# EAGLE design attiniest85-batty-shield-mk-1.0 (EAGLE 6.5.0)
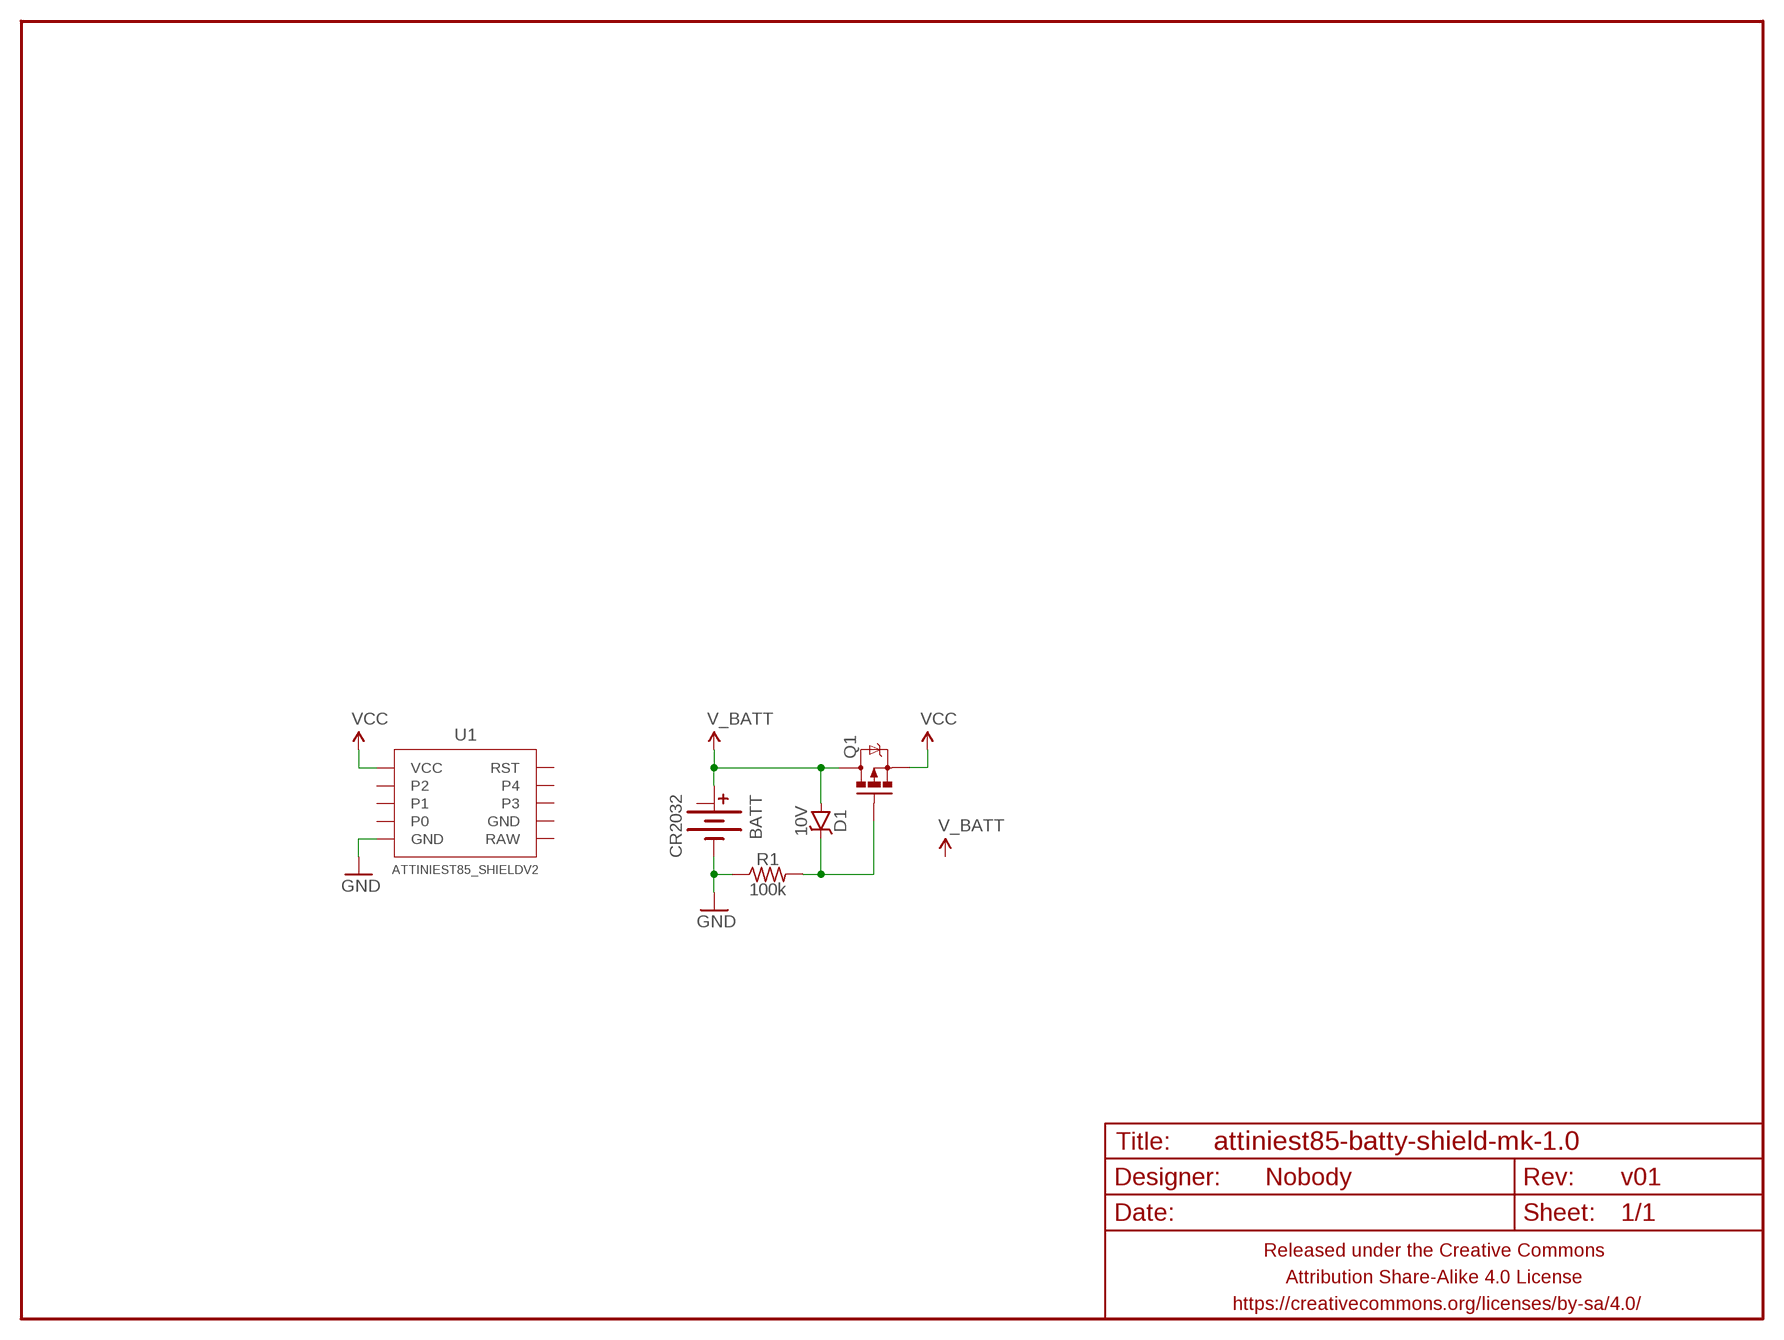
[diagram p0: schematic, sheet 1]

## Parts
BATT  CR2032  BATTERY-COINCR2032_SMD  [BATTCON_20MM_MINE]
D1  10V  DIODE-ZENER7.62MM-PTH  [DIODE-ZENNER-7.62MM]
FRAME1  FRAME-LETTERNO_PACKAGE  [DUMMY]
Q1  MOSFET-PCHANNELTO-92-INLINE-DGS  [TO-92-AMMO]
R1  100k  RESISTORPTH-AXIAL-7.62MM  [RESISTOR-AXIAL-PTH-7.62MM]
U1  ATTINIEST85_SHIELDV2  [ATTINIEST85_SHIELD_V2]

## Nets
GND: BATT.BOTTOM(-) R1.P$1 U1.GND@2(GND)
N$1: D1.K(C) Q1.2(G) R1.P$2
V_BATT: BATT.TOP@1(+) D1.A Q1.1(D)
VCC: Q1.3(S) U1.VCC
Unconnected: BATT.TOP@2(+1) U1.0 U1.1 U1.2 U1.3 U1.4 U1.GND@1(GND) U1.RAW U1.RST

## Library data of the parts
BATT = A_butts:BATTERY-COIN
D1 = A_butts:DIODE-ZENER: Zener Diode Production Part - 8199 3.4V Zener Voltage
FRAME1 = A_butts:FRAME-LETTER: Schematic Frame Standard 8.5x11 US Letter frame; DESIGNER: Nobody; VERSION: v01
Q1 = A_butts:MOSFET-PCHANNEL: Generic PMOSFET IRLML2244 - TRANS-11153 (SOT-23 -20V -4.3A) (1.Gate 2.Source 3.Drain) FQP27P06 - COM-10349 <http://www.sparkfun.com/products/10349> (TO-220 -60V -27A) (1.Gate 2.Source 3.Drain)
R1 = A_butts:RESISTOR: RESISTOR, American symbol
U1 = A_butts:ATTINIEST85_SHIELD

## Board
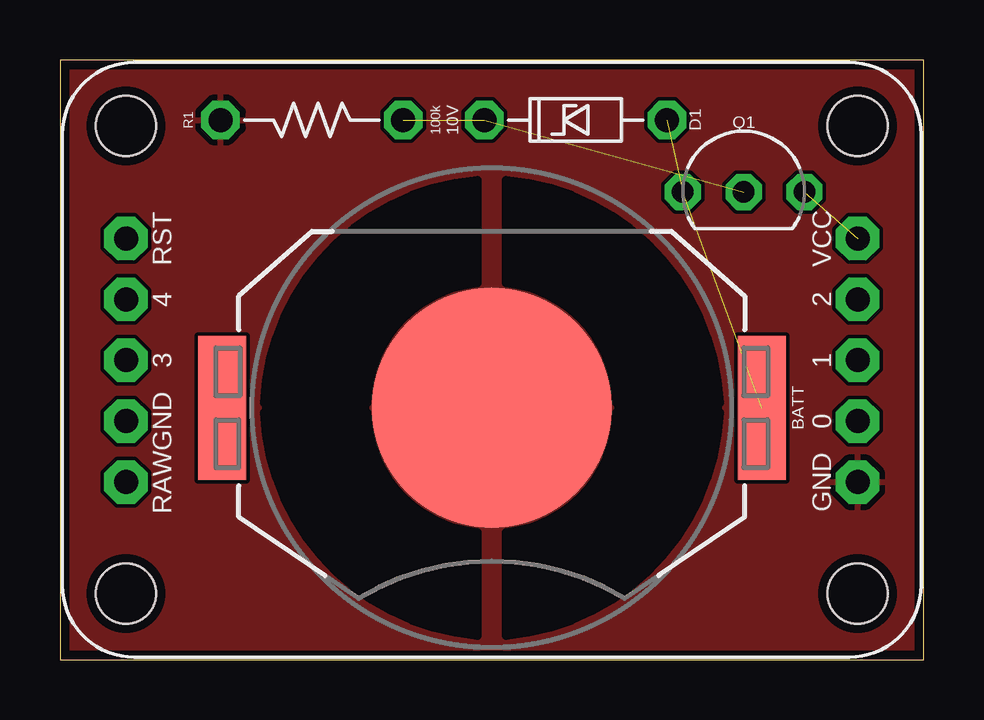
[diagram p1: board, top side]
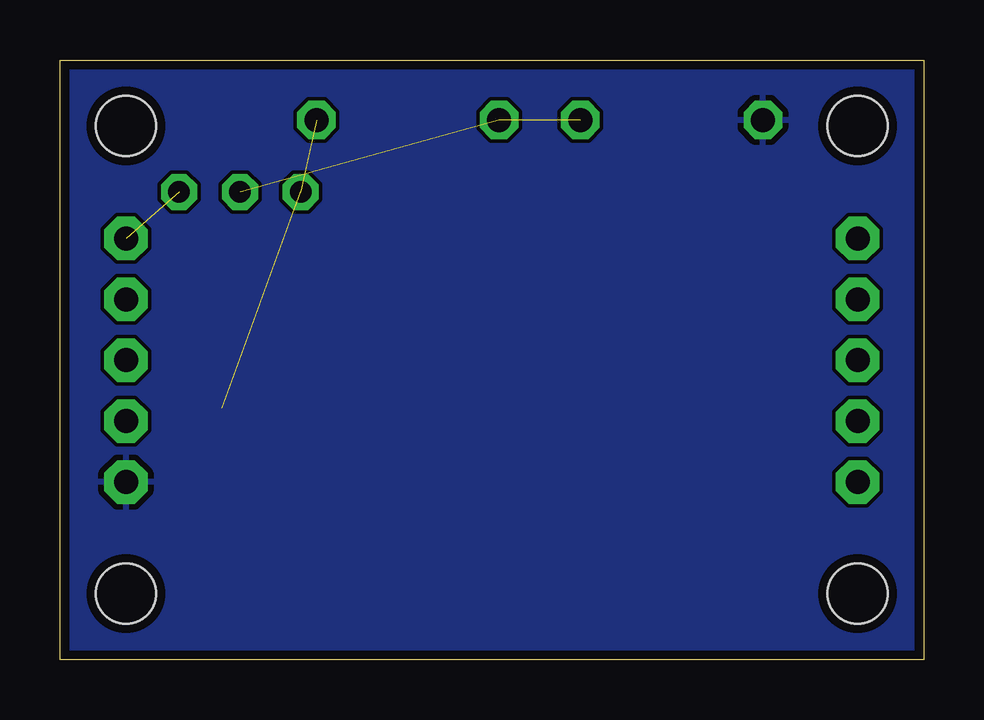
[diagram p2: board, bottom side, seen from below]

Size 36 x 25 mm. Coordinates in mm from the lower left corner, seen from the top.
Outline: 0,0 36,0 36,25 0,25 0,0
Copper layers (1*16): Top 0.0356mm / dielectric 1.5011mm / Bottom 0.0356mm
Design rules "LaenPCBOrder_2": minimum track width 6mil, minimum drill 13mil, track to track 6mil, track to pad 6mil, pad to pad 6mil, via to via 6mil, smd to smd 6mil, copper to edge 15mil, drill to drill 6mil, minimum pad ring 7mil, minimum via ring 7mil, stop-mask expansion 3mil, vias tented up to drill 20mil, thermal gap 10mil

### Footprints (pad centres in the part's own frame; a part is rotated, then mirrored left to right if it is on the bottom)
BATTCON_20MM_MINE = smd 10 x 10: BOTTOM 0,0 | smd 6 x 2: TOP@1 0,11.25; TOP@2 0,-11.25
DIODE-ZENNER-7.62MM = drill 1 pad 1.6 octagon: A -3.81,0; K 3.81,0
TO-92-AMMO = drill 0.9 pad 1.5 octagon: 1 -2.54,0; 2 0,0; 3 2.54,0
RESISTOR-AXIAL-PTH-7.62MM = drill 1 pad 1.6 octagon: P$1 -3.81,0; P$2 3.81,0
ATTINIEST85_SHIELD_V2 = drill 1 pad 1.8 octagon: 0 15.25,-2.56; 1 15.25,-0.02; 2 15.25,2.52; 3 -15.25,-0.02; 4 -15.25,2.52; GND@1 -15.25,-2.56; GND@2 15.25,-5.1; RAW -15.25,-5.1; RST -15.25,5.06; VCC 15.25,5.06 | hole 2.5: -15.25,-9.75; -15.25,9.75; 15.25,9.75; 15.25,-9.75

### Placement (x,y rotation side)
BATT  18,10.5 270 top
D1  21.5,22.5 180 top
FRAME1  0,0 0 top
Q1  28.5,19.5 0 top
R1  10.5,22.5 0 top
U1  18,12.5 0 top

### Tracks (layer width: path | path; a pad name or v marks a point on that pad's centre or on a via)
GND
  pour Top: -0.1,-0.1 -0.1,25.1 36.1,25.1 36.1,-0.1
  pour Bottom: -0.1,-0.1 -0.1,25.1 36.1,25.1 36.1,-0.1
N$1  (2 unrouted)
V_BATT  (2 unrouted)
VCC  (1 unrouted)